# EAGLE schematic MB_2 (EAGLE 9.2.2)

## Sheet 1 of 4: Avionics
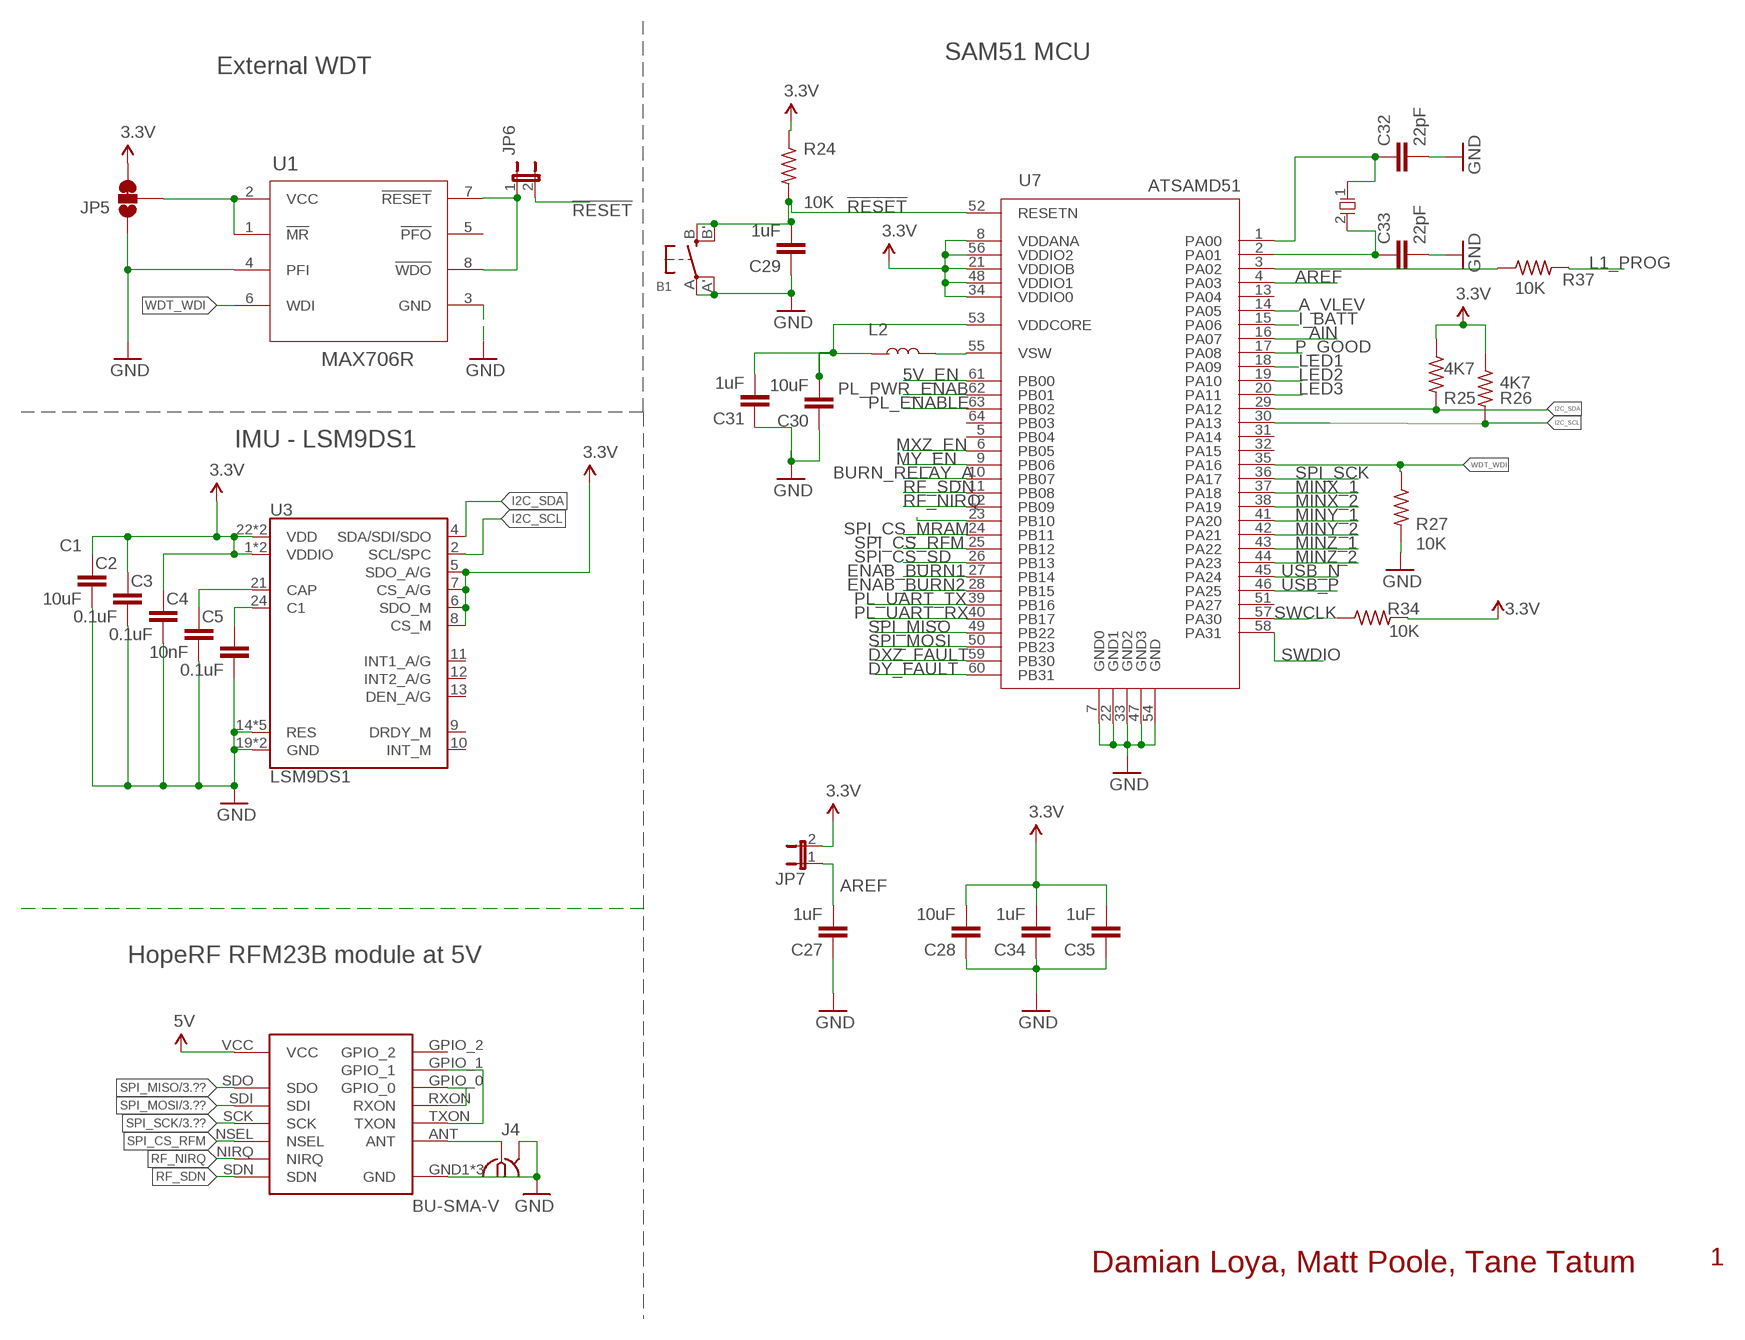
[diagram p0: schematic, sheet 1]

### Parts
B1  SWITCH_TACT_SMT4.6X2.8  [BTN_KMR2_4.6X2.8]
C1  10uF  10UF-6.3V-20%(0603)  [0603-CAP]
C2  0.1uF  0.1UF-25V(+80/-20%)(0603)  [0603-CAP]
C3  0.1uF  0.1UF-25V(+80/-20%)(0603)  [0603-CAP]
C4  10nF  10NF/10000PF-50V-10%(0603)  [0603-CAP]
C5  0.1uF  0.1UF-25V(+80/-20%)(0603)  [0603-CAP]
C27  1uF  C-EUC0603  [C0603]
C28  10uF  C-EUC0603  [C0603]
C29  1uF  C-EUC0603  [C0603]
C30  10uF  C-EUC0603  [C0603]
C31  1uF  C-EUC0603  [C0603]
C32  22pF  C-EUC0603  [C0603]
C33  22pF  C-EUC0603  [C0603]
C34  1uF  C-EUC0603  [C0603]
C35  1uF  C-EUC0603  [C0603]
J4  BU-SMA-V  [BU-SMA-V]
JP5  JUMPER-PAD-3-2OF3_NC_BY_TRACE_SMALL  [PAD-JUMPER-3-2OF3_NC_BY_TRACE_YES_SILK_FULL_BOX]
JP6  JP1E  [JP1]
JP7  JP1E  [JP1]
L2  10uH  CM322522  [1210]
R24  10K  R-US_R0603  [R0603]
R25  4K7  R-US_R0603  [R0603]
R26  4K7  R-US_R0603  [R0603]
R27  10K  R-US_R0603  [R0603]
R34  10K  R-US_R0603  [R0603]
R37  10K  R-US_R0603  [R0603]
U1  MAX706R  MAX708RESA-T  [SO8]
U3  LSM9DS1  [LGA24-8X4]
U5  RFM23BP  [RFM23BP]
U7  ATSAMD51  [TQFP-64]
X1  ECX-31B  [ECX-31B]

### Nets
3.3V: C1.1 C2.1 C3.1 C28.2 C34.2 C35.2 JP5.3 JP7.2 R24.1 R25.1 R26.1 R34.2 U3.1(VDDIO) U3.3(VDDIO) U3.5(SDO_A/G) U3.6(SDO_M) U3.7(CS_A/G) U3.8(CS_M) U3.22(VDD) U3.23(VDD) U7.8(VDDANA) U7.21(VDDIOB) U7.34(VDDIO0) U7.48(VDDIO1) U7.56(VDDIO2) ; also sheet 2,3
5V: U5.VCC ; also sheet 2
5V_EN: U7.61(PB00) ; also sheet 2
!RESET: B1.B'(S1) B1.B(S) C29.2 JP6.2 R24.2 U7.52(RESETN) ; also sheet 3
A_VLEV: U7.14(PA05) ; also sheet 2
AIN: U7.16(PA07)
AREF: C27.2 JP7.1 U7.4(PA03)
BURN_RELAY_A: U7.10(PB07) ; also sheet 4
DXZ_FAULT: U7.59(PB30) ; also sheet 4
DY_FAULT: U7.60(PB31) ; also sheet 4
ENAB_BURN1: U7.27(PB14) ; also sheet 4
ENAB_BURN2: U7.28(PB15) ; also sheet 4
GND: B1.A'(P1) B1.A(P) C1.2 C2.2 C3.2 C4.2 C5.2 C27.1 C28.1 C29.1 C30.1 C31.1 C32.2 C33.2 C34.1 C35.1 J4.2 J4.3 J4.4 J4.5 JP5.1 R27.2 U1.3(GND) U1.4(PFI) U3.14(RES) U3.15(RES) U3.16(RES) U3.17(RES) U3.18(RES) U3.19(GND) U3.20(GND) U5.GND1(GND) U5.GND2(GND) U5.GND3(GND) U7.7(GND0) U7.22(GND1) U7.33(GND2) U7.47(GND3) U7.54(GND) ; also sheet 2,3,4
I2C_SCL: R26.2 U3.2(SCL/SPC) U7.30(PA13)
I2C_SDA: R25.2 U3.4(SDA/SDI/SDO) U7.29(PA12)
I_BATT: U7.15(PA06) ; also sheet 2
L1_PROG: R37.2 ; also sheet 2
LED1: U7.18(PA09) ; also sheet 2
LED2: U7.19(PA10) ; also sheet 2
LED3: U7.20(PA11) ; also sheet 2
LED4: U7.23(PB10) ; also sheet 2
MINX_1: U7.37(PA18) ; also sheet 4
MINX_2: U7.38(PA19) ; also sheet 4
MINY_1: U7.41(PA20) ; also sheet 4
MINY_2: U7.42(PA21) ; also sheet 4
MINZ_1: U7.43(PA22) ; also sheet 4
MINZ_2: U7.44(PA23) ; also sheet 4
MXZ_EN: U7.6(PB05) ; also sheet 4
MY_EN: U7.9(PB06) ; also sheet 4
N$1: JP6.1 U1.7(!RESET) U1.8(!WDO)
N$2: C4.1 U3.21(CAP)
N$6: C5.1 U3.24(C1)
N$8: JP5.2 U1.1(!MR) U1.2(VCC)
N$15: L2.2 U7.55(VSW)
N$29: C32.1 U7.1(PA00) X1.1
N$36: J4.1 U5.ANT
N$37: U5.GPIO_0 U5.RXON
N$39: U5.GPIO_1 U5.TXON
N$43: C30.2 C31.2 L2.1 U7.53(VDDCORE)
N$44: C33.1 U7.2(PA01) X1.2
N$56: R37.1 U7.3(PA02)
P_GOOD: U7.17(PA08) ; also sheet 2
PL_ENABLE: U7.63(PB02) ; also sheet 3
PL_PWR_ENAB: U7.62(PB01) ; also sheet 2
PL_UART_RX: U7.40(PB17) ; also sheet 3
PL_UART_TX: U7.39(PB16) ; also sheet 3
RF_NIRQ: U5.NIRQ U7.12(PB09)
RF_SDN: U5.SDN U7.11(PB08)
SPI_CS_MRAM: U7.24(PB11) ; also sheet 3
SPI_CS_RFM: U5.NSEL U7.25(PB12)
SPI_CS_SD: U7.26(PB13) ; also sheet 3
SPI_MISO: U5.SDO U7.49(PB22) ; also sheet 3
SPI_MOSI: U5.SDI U7.50(PB23) ; also sheet 3
SPI_SCK: U5.SCK U7.36(PA17) ; also sheet 3
SWCLK: R34.1 U7.57(PA30) ; also sheet 3
SWDIO: U7.58(PA31) ; also sheet 3
USB_N: U7.45(PA24) ; also sheet 3
USB_P: U7.46(PA25) ; also sheet 3
WDT_WDI: R27.1 U1.6(WDI) U7.35(PA16)
Unconnected: U1.5(!PFO) U3.9(DRDY_M) U3.10(INT_M) U3.11(INT1_A/G) U3.12(INT2_A/G) U3.13(DEN_A/G) U5.GPIO_2 U7.5(PB04) U7.13(PA04) U7.31(PA14) U7.32(PA15) U7.51(PA27) U7.64(PB03)

### Notes on the sheet
- SAM51 MCU
- External WDT
- Decide on HOLD and !WP
- IMU - LSM9DS1
- HopeRF RFM23B module at 5V
- To Do:
  Characterize power consumption
  Validate SPI pinout of SAMD21
- Damian Loya, Matt Poole, Tane Tatum | 1

## Sheet 2 of 4: Power
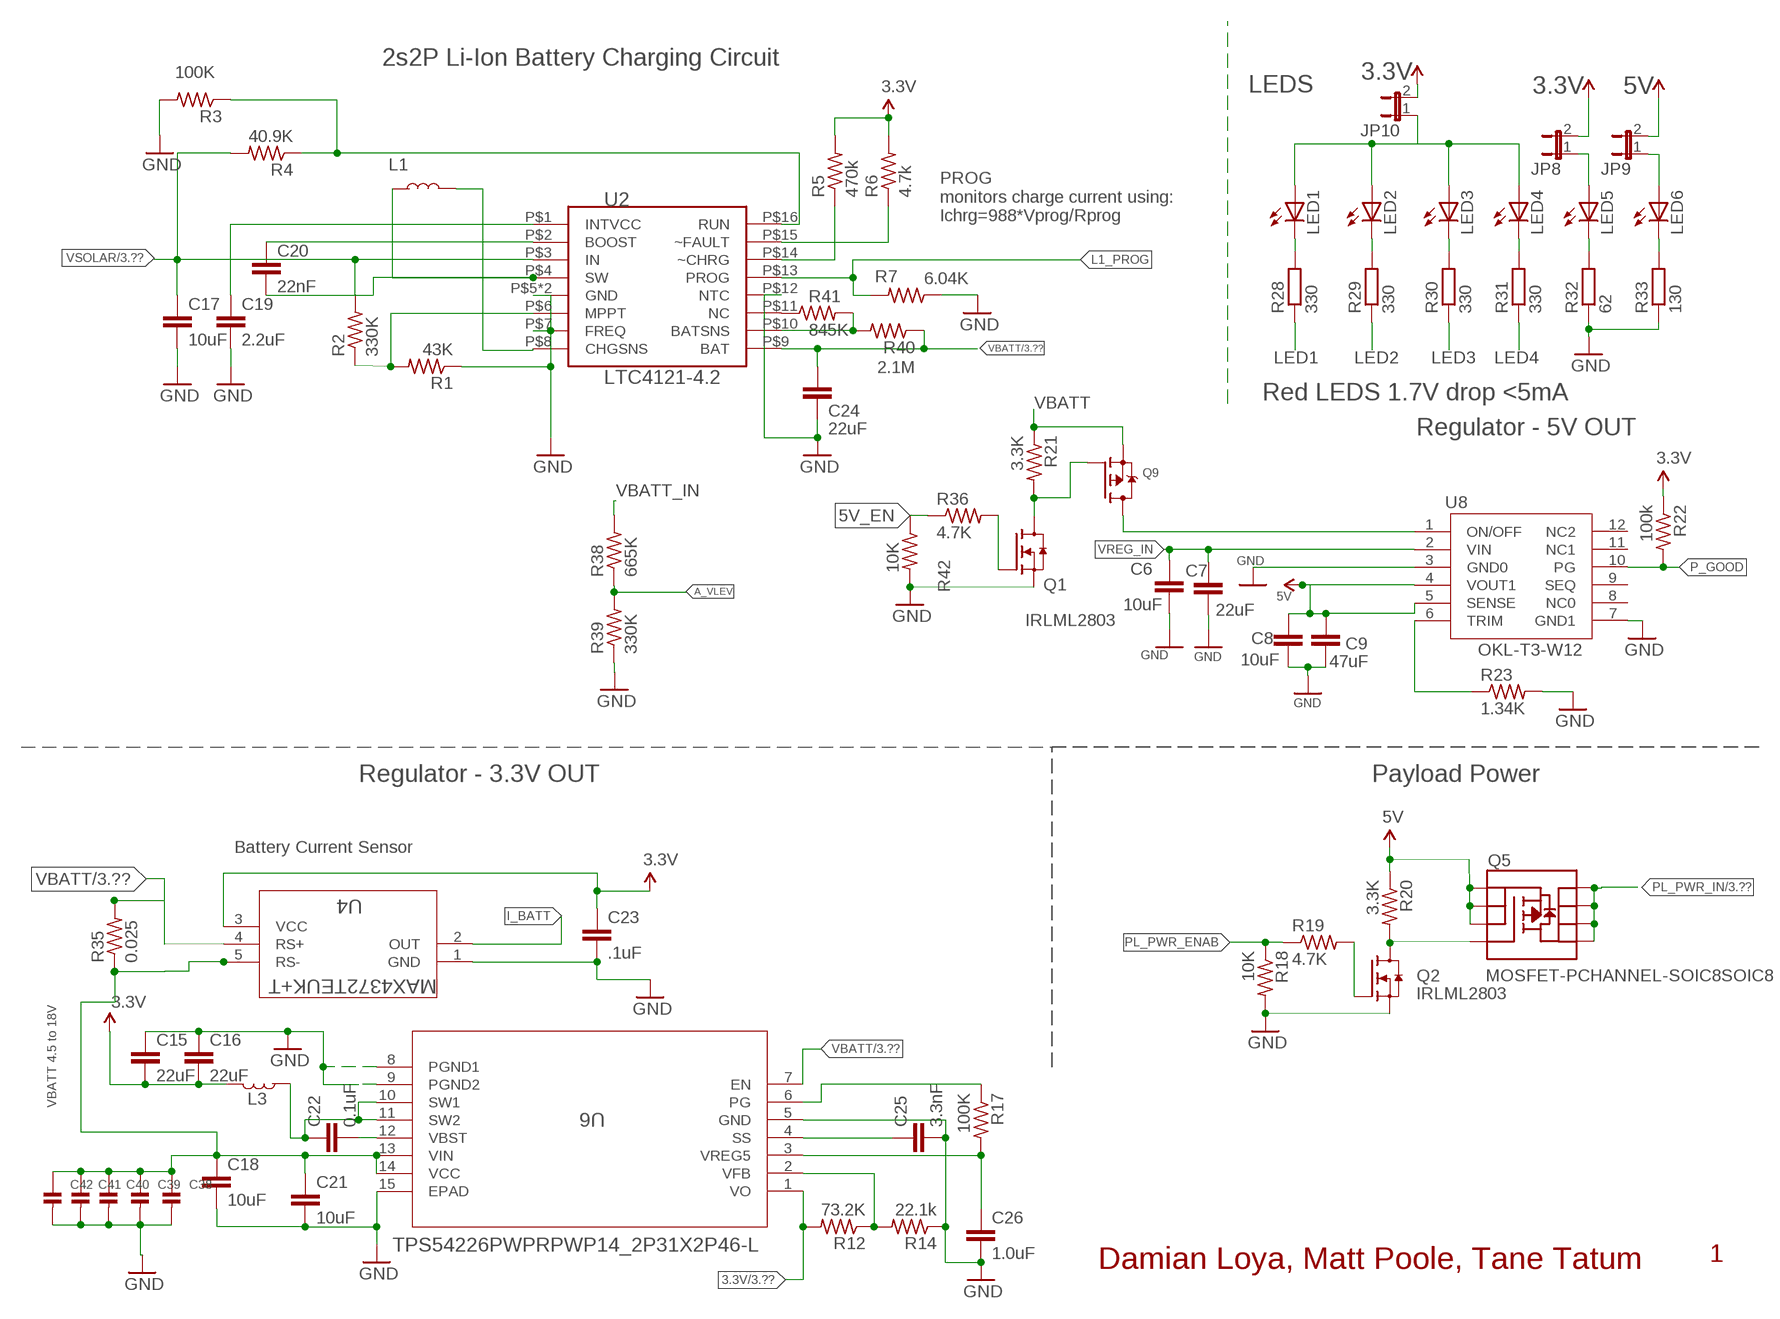
[diagram p1: schematic, sheet 2]

### Parts
C6  10uF  10UF-0603-6.3V-20%  [0603]
C7  22uF  10UF-0603-6.3V-20%  [0603]
C8  10uF  10UF-0603-6.3V-20%  [0603]
C9  47uF  10UF-0603-6.3V-20%  [0603]
C15  22uF  22UF-0805-6.3V-20%  [0805]
C16  22uF  22UF-0805-6.3V-20%  [0805]
C17  10uF  10UF-0603-6.3V-20%  [0603]
C18  10uF  10UF-0603-6.3V-20%  [0603]
C19  2.2uF  2.2UF-0603-10V-20%  [0603]
C20  22nF  2.2NF/2200PF-0603-50V-10%  [0603]
C21  10uF  10UF-0603-6.3V-20%  [0603]
C22  0.1uF  1.0UF-0603-16V-10%  [0603]
C23  .1uF  CAP0603-CAP  [0603-CAP]
C24  22uF  0.1UF-0603-25V-5%  [0603]
C25  3.3nF  3.3NF-0603-100V-10%  [0603]
C26  1.0uF  1.0UF-0603-16V-10%  [0603]
C38  CAP_CERAMIC1206  [1206]
C39  CAP_CERAMIC1206  [1206]
C40  CAP_CERAMIC1206  [1206]
C41  CAP_CERAMIC1206  [1206]
C42  CAP_CERAMIC1206  [1206]
JP8  JP1E  [JP1]
JP9  JP1E  [JP1]
JP10  JP1E  [JP1]
L1  56uH  CM322522  [1210]
L3  3.3uH  CM322522  [1210]
LED1  LEDCHIP-LED0603  [CHIP-LED0603]
LED2  LEDCHIP-LED0603  [CHIP-LED0603]
LED3  LEDCHIP-LED0603  [CHIP-LED0603]
LED4  LEDCHIP-LED0603  [CHIP-LED0603]
LED5  LEDCHIP-LED0603  [CHIP-LED0603]
LED6  LEDCHIP-LED0603  [CHIP-LED0603]
Q1  IRLML2803  IRLML2803TRPBF  [SOT-23]
Q2  IRLML2803  IRLML2803TRPBF  [SOT-23]
Q5  MOSFET-PCHANNEL-SOIC8SOIC8  [SO08]
Q9  MOSFET-PWIDE  [SOT23-WIDE]
R1  43K  R-US_R0603  [R0603]
R2  330K  R-US_R0603  [R0603]
R3  100K  R-US_R0603  [R0603]
R4  40.9K  R-US_R0603  [R0603]
R5  470k  R-US_R0603  [R0603]
R6  4.7k  R-US_R0603  [R0603]
R7  6.04K  R-US_R0603  [R0603]
R12  73.2K  R-US_R0603  [R0603]
R14  22.1k  R-US_R0603  [R0603]
R17  100K  R-US_R0603  [R0603]
R18  10K  R-US_R0603  [R0603]
R19  4.7K  R-US_R0603  [R0603]
R20  3.3K  R-US_R0603  [R0603]
R21  3.3K  R-US_R0603  [R0603]
R22  100k  R-US_R0603  [R0603]
R23  1.34K  R-US_R0603  [R0603]
R28  330  R-EU_R0603  [R0603]
R29  330  R-EU_R0603  [R0603]
R30  330  R-EU_R0603  [R0603]
R31  330  R-EU_R0603  [R0603]
R32  62  R-EU_R0603  [R0603]
R33  130  R-EU_R0603  [R0603]
R35  0.025  R-US_R1210  [R1210]
R36  4.7K  R-US_R0603  [R0603]
R38  665K  R-US_R0603  [R0603]
R39  330K  R-US_R0603  [R0603]
R40  2.1M  R-US_R0603  [R0603]
R41  845K  R-US_R0603  [R0603]
R42  10K  R-US_R0603  [R0603]
U2  LTC4121-4.2  [QFN-16-PAD]
U4  MAX4372TEUK+T  [21-0057F]
U6  TPS54226PWPRPWP14_2P31X2P46-L  [PWP14_2P31X2P46-L]
U8  OKL-T3-W12  [OKL-T3-W12]

### Nets
3.3V: C15.2 C16.2 C23.1 JP8.2 JP10.2 L3.2 R5.2 R6.2 R12.2 R22.1 U4.3(VCC) U6.1(VO) ; also sheet 1,3
5V: C8.1 C9.1 JP9.2 Q5.1(S) Q5.2(S) Q5.3(S) R20.1 U8.4(VOUT1) U8.5(SENSE) ; also sheet 1
5V_EN: R36.1 R42.1 ; also sheet 1
A_VLEV: R38.1 R39.2 ; also sheet 1
GND: C6.2 C7.2 C8.2 C9.2 C15.1 C16.1 C17.2 C18.2 C19.2 C21.2 C23.2 C24.2 C25.2 C26.2 C38.2 C39.2 C40.2 C41.2 C42.2 Q1.2(S) Q2.2(S) R1.1 R3.2 R7.1 R14.1 R18.2 R23.2 R32.1 R33.1 R39.1 R42.2 U2.P$5(GND) U2.P$7(FREQ) U2.P$12(NTC) U2.P$17(GND) U4.1(GND) U6.5(GND) U6.8(PGND1) U6.9(PGND2) U6.15(EPAD) U8.3(GND0) U8.7(GND1) ; also sheet 1,3,4
I_BATT: U4.2(OUT) ; also sheet 1
L1_CHG: R3.1 R4.1 U2.P$16(RUN)
L1_FAULTN: R6.1 U2.P$15(~FAULT)
L1_PROG: R7.2 U2.P$13(PROG) ; also sheet 1
LED1: R28.1 ; also sheet 1
LED2: R29.1 ; also sheet 1
LED3: R30.1 ; also sheet 1
LED4: R31.1 ; also sheet 1
N$3: C22.1 L3.1 U6.10(SW1) U6.11(SW2)
N$5: L1.2 U2.P$8(CHGSNS)
N$7: C20.2 L1.1 U2.P$4(SW)
N$9: C20.1 U2.P$2(BOOST)
N$10: Q2.1(G) R19.2
N$11: C19.1 U2.P$1(INTVCC)
N$12: Q2.3(D) Q5.4(G) R20.2
N$13: R1.2 R2.1 U2.P$6(MPPT)
N$14: C22.2 U6.12(VBST)
N$16: R5.1 U2.P$14(~CHRG)
N$17: R40.2 R41.2 U2.P$10(BATSNS)
N$18: Q1.3(D) Q9.1(G) R21.2
N$19: R23.1 U8.6(TRIM)
N$23: Q1.1(G) R36.2
N$27: LED1.C R28.2
N$32: Q9.3(D) U8.1(ON/OFF)
N$45: LED2.C R29.2
N$46: C26.1 R17.2 U6.3(VREG5)
N$47: LED3.C R30.2
N$48: LED4.C R31.2
N$49: LED5.C R32.2
N$50: LED6.C R33.2
N$51: C25.1 U6.4(SS)
N$52: R12.1 R14.2 U6.2(VFB)
N$53: JP8.1 LED5.A
N$54: R41.1 U2.P$11(NC)
N$55: JP9.1 LED6.A
N$60: JP10.1 LED1.A LED2.A LED3.A LED4.A
P_GOOD: R22.2 U8.10(PG) ; also sheet 1
PGOOD: R17.1 U6.6(PG)
PL_PWR_ENAB: R18.1 R19.1 ; also sheet 1
PL_PWR_IN: Q5.5(D) Q5.6(D) Q5.7(D) Q5.8(D) ; also sheet 3
VBATT: C24.1 Q9.2(S) R21.1 R35.2 R40.1 U2.P$9(BAT) U4.4(RS+) U6.7(EN) ; also sheet 3,4
VBATT_IN: R38.2 ; also sheet 3
VREG_IN: C6.1 C7.1 C18.1 C21.1 C38.1 C39.1 C40.1 C41.1 C42.1 R35.1 U4.5(RS-) U6.13(VIN) U6.14(VCC) U8.2(VIN)
VSOLAR: C17.1 R2.2 R4.2 U2.P$3(IN) ; also sheet 3
Unconnected: U8.8(NC0) U8.9(SEQ) U8.11(NC1) U8.12(NC2)

### Notes on the sheet
- 2s2P Li-Ion Battery Charging Circuit
- LEDS
- PROG
  monitors charge current using:
  Ichrg=988*Vprog/Rprog
- Red LEDS 1.7V drop <5mA
- Regulator - 5V OUT
- Regulator - 3.3V OUT | Payload Power
- Battery Current Sensor
- VBATT 4.5 to 18V
- Damian Loya, Matt Poole, Tane Tatum | 1

## Sheet 3 of 4: Connectors
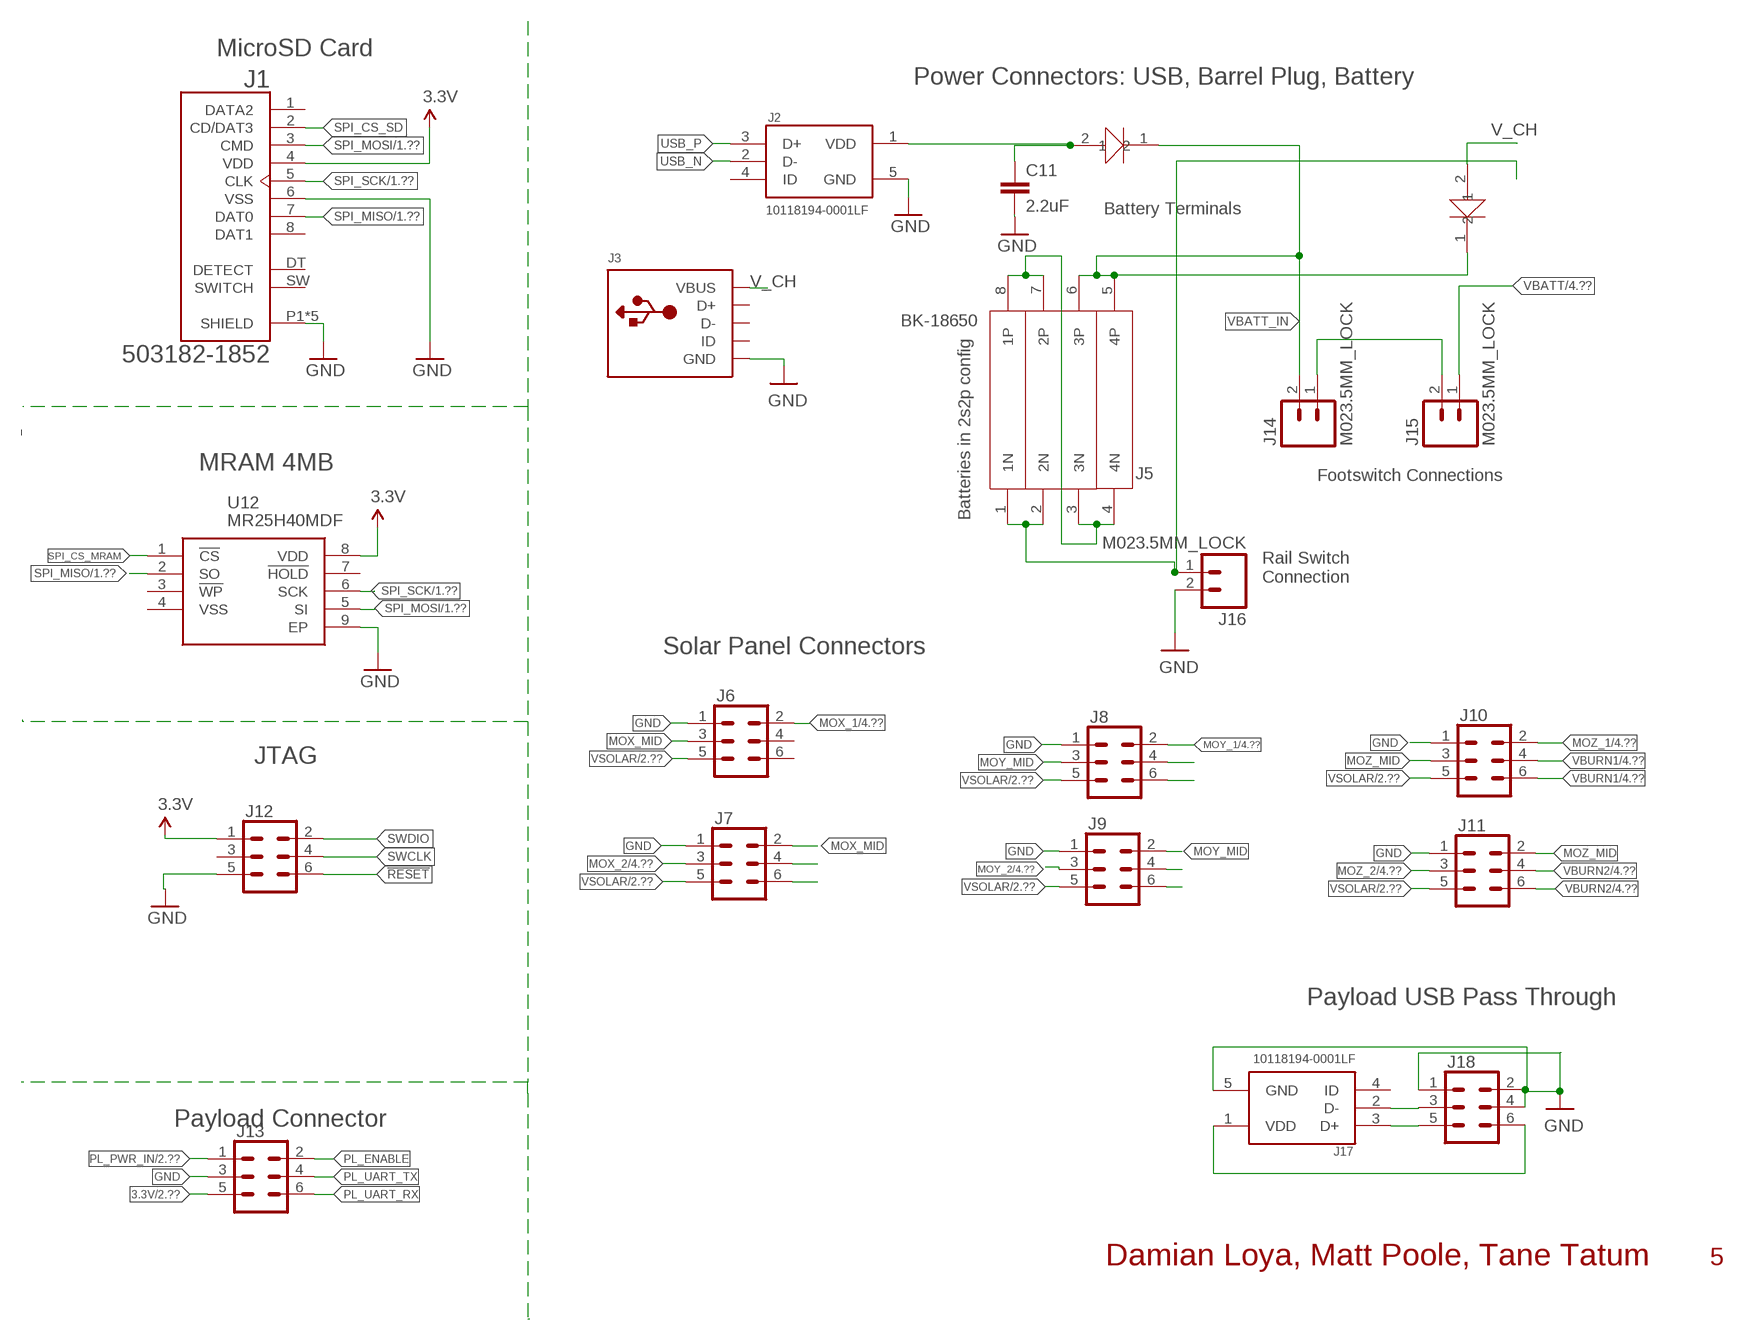
[diagram p2: schematic, sheet 3]

### Parts
C11  2.2uF  2.2UF-0603-10V-20%  [0603]
D1  RBR5LAM60ATF  [SOD-128]
D2  RBR5LAM60ATF  [SOD-128]
J1  503182-1852  [MOLEX_503182-1852]
J2  10118194-0001LF  [FRAMATOME_10118194-0001LF]
J3  USBMOLEX  [USB-MINIB-THM-MOLEX]
J5  BK-18650  [BK-18650]
J6  CONN_03X22X3_SILK_MALE_PTH  [2X3]
J7  CONN_03X22X3_SILK_MALE_PTH  [2X3]
J8  CONN_03X22X3_SILK_MALE_PTH  [2X3]
J9  CONN_03X22X3_SILK_MALE_PTH  [2X3]
J10  CONN_03X22X3_SILK_MALE_PTH  [2X3]
J11  CONN_03X22X3_SILK_MALE_PTH  [2X3]
J12  CONN_03X22X3_SILK_MALE_PTH  [2X3]
J13  CONN_03X22X3_SILK_MALE_PTH  [2X3]
J14  M023.5MM_LOCK  [SCREWTERMINAL-3.5MM-2_LOCK]
J15  M023.5MM_LOCK  [SCREWTERMINAL-3.5MM-2_LOCK]
J16  M023.5MM_LOCK  [SCREWTERMINAL-3.5MM-2_LOCK]
J17  10118194-0001LF  [FRAMATOME_10118194-0001LF]
J18  CONN_03X22X3_SILK_MALE_PTH  [2X3]
U12  MR25H40MDF  [SON127P600X500X90-9N]

### Nets
3.3V: J1.4(VDD) J12.1 J13.5 U12.8(VDD) ; also sheet 1,2
!RESET: J12.6 ; also sheet 1
GND: C11.2 J1.6(VSS) J1.P1(SHIELD) J1.P2(SHIELD) J1.P3(SHIELD) J1.P4(SHIELD) J1.P5(SHIELD) J2.5(GND) J3.GND J6.1 J7.1 J8.1 J9.1 J10.1 J11.1 J12.5 J13.3 J16.2 J17.5(GND) J18.1 J18.2 J18.4 U12.9(EP) ; also sheet 1,2,4
MOX_1: J6.2 ; also sheet 4
MOX_2: J7.3 ; also sheet 4
MOX_MID: J6.3 J7.2
MOY_1: J8.2 ; also sheet 4
MOY_2: J9.3 ; also sheet 4
MOY_MID: J8.3 J9.2
MOZ_1: J10.2 ; also sheet 4
MOZ_2: J11.3 ; also sheet 4
MOZ_MID: J10.3 J11.2
N$4: J14.1 J15.2
N$20: C11.1 D2.2 J2.1(VDD)
N$21: J17.2(D-) J18.3
N$22: J17.3(D+) J18.5
N$40: J17.1(VDD) J18.6
N$41: J5.3(3N) J5.4(4N) J5.7(2P) J5.8(1P)
N$59: J5.1(1N) J5.2(2N) J16.1
N$63: J7.6
N$64: J7.4
N$65: J8.6
N$66: J8.4
N$67: J9.6
N$68: J9.4
PL_ENABLE: J13.2 ; also sheet 1
PL_PWR_IN: J13.1 ; also sheet 2
PL_UART_RX: J13.6 ; also sheet 1
PL_UART_TX: J13.4 ; also sheet 1
SPI_CS_MRAM: U12.1(!CS) ; also sheet 1
SPI_CS_SD: J1.2(CD/DAT3) ; also sheet 1
SPI_MISO: J1.7(DAT0) U12.2(SO) ; also sheet 1
SPI_MOSI: J1.3(CMD) U12.5(SI) ; also sheet 1
SPI_SCK: J1.5(CLK) U12.6(SCK) ; also sheet 1
SWCLK: J12.4 ; also sheet 1
SWDIO: J12.2 ; also sheet 1
USB_N: J2.2(D-) ; also sheet 1
USB_P: J2.3(D+) ; also sheet 1
V_CH: D1.2 J3.VBUS
VBATT: J15.1 ; also sheet 2,4
VBATT_IN: D1.1 D2.1 J5.5(4P) J5.6(3P) J14.2 ; also sheet 2
VBURN1: J10.4 J10.6 ; also sheet 4
VBURN2: J11.4 J11.6 ; also sheet 4
VSOLAR: J6.5 J7.5 J8.5 J9.5 J10.5 J11.5 ; also sheet 2
Unconnected: J1.1(DATA2) J1.8(DAT1) J1.DT(DETECT) J1.SW(SWITCH) J2.4(ID) J3.D+ J3.D- J3.ID J6.4 J6.6 J12.3 J17.4(ID) U12.3(!WP) U12.4(VSS) U12.7(!HOLD)

### Notes on the sheet
- MicroSD Card
- Power Connectors: USB, Barrel Plug, Battery
- Battery Terminals
- MRAM 4MB
- Footswitch Connections
- Batteries in 2s2p config
- Rail Switch
  Connection
- Solar Panel Connectors
- JTAG
- Payload USB Pass Through
- Payload Connector
- Damian Loya, Matt Poole, Tane Tatum | 5

## Sheet 4 of 4: Burn Wires and H-Bridges
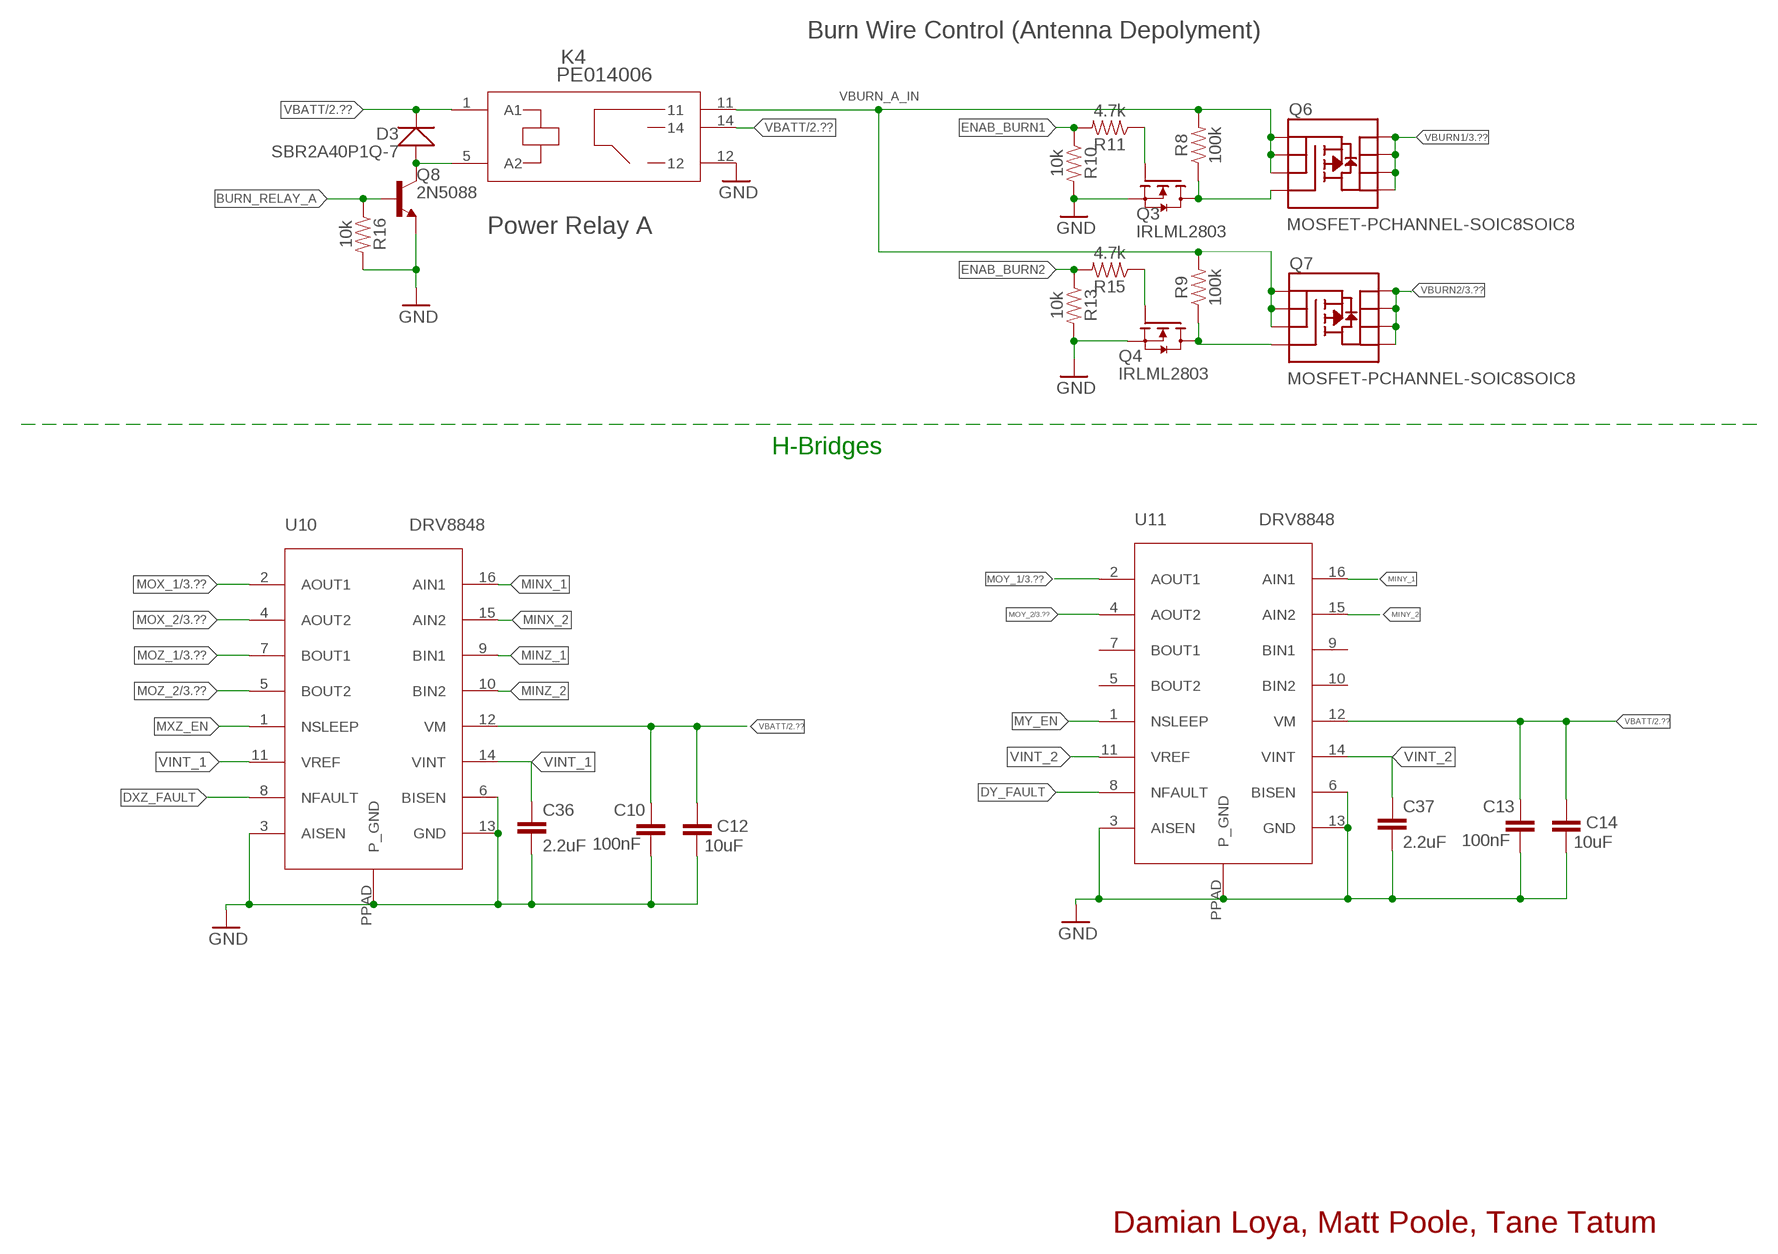
[diagram p3: schematic, sheet 4]

### Parts
C10  100nF  10UF-0603-6.3V-20%  [0603]
C12  10uF  10UF-0603-6.3V-20%  [0603]
C13  100nF  10UF-0603-6.3V-20%  [0603]
C14  10uF  10UF-0603-6.3V-20%  [0603]
C36  2.2uF  CAP0603-CAP  [0603-CAP]
C37  2.2uF  CAP0603-CAP  [0603-CAP]
D3  SBR2A40P1Q-7  DFLS130L  [PWRDI-123]
K4  PE014006  PE014005  [RELAY5-PE_CO]
Q3  IRLML2803  IRLML2803TRPBF  [SOT-23]
Q4  IRLML2803  IRLML2803TRPBF  [SOT-23]
Q6  MOSFET-PCHANNEL-SOIC8SOIC8  [SO08]
Q7  MOSFET-PCHANNEL-SOIC8SOIC8  [SO08]
Q8  2N5088  BC846  [SOT23]
R8  100k  RESISTOR0603  [0603]
R9  100k  RESISTOR0603  [0603]
R10  10k  RESISTOR0603  [0603]
R11  4.7k  RESISTOR0603  [0603]
R13  10k  RESISTOR0603  [0603]
R15  4.7k  RESISTOR0603  [0603]
R16  10k  RESISTOR0603  [0603]
U10  DRV8848  [HTSSOP]
U11  DRV8848  [HTSSOP]

### Nets
BURN_RELAY_A: Q8.1(B) R16.1 ; also sheet 1
DXZ_FAULT: U10.8(NFAULT) ; also sheet 1
DY_FAULT: U11.8(NFAULT) ; also sheet 1
ENAB_BURN1: R10.1 R11.2 ; also sheet 1
ENAB_BURN2: R13.1 R15.2 ; also sheet 1
GND: C10.2 C12.2 C13.2 C14.2 C36.2 C37.2 K4.12 Q3.2(S) Q4.2(S) Q8.2(E) R10.2 R13.2 R16.2 U10.3(AISEN) U10.6(BISEN) U10.13(GND) U10.PPAD(P_GND) U11.3(AISEN) U11.6(BISEN) U11.13(GND) U11.PPAD(P_GND) ; also sheet 1,2,3
MINX_1: U10.16(AIN1) ; also sheet 1
MINX_2: U10.15(AIN2) ; also sheet 1
MINY_1: U11.16(AIN1) ; also sheet 1
MINY_2: U11.15(AIN2) ; also sheet 1
MINZ_1: U10.9(BIN1) ; also sheet 1
MINZ_2: U10.10(BIN2) ; also sheet 1
MOX_1: U10.2(AOUT1) ; also sheet 3
MOX_2: U10.4(AOUT2) ; also sheet 3
MOY_1: U11.2(AOUT1) ; also sheet 3
MOY_2: U11.4(AOUT2) ; also sheet 3
MOZ_1: U10.7(BOUT1) ; also sheet 3
MOZ_2: U10.5(BOUT2) ; also sheet 3
MXZ_EN: U10.1(NSLEEP) ; also sheet 1
MY_EN: U11.1(NSLEEP) ; also sheet 1
N$31: Q3.3(D) Q6.4(G) R8.1
N$33: Q3.1(G) R11.1
N$34: Q4.1(G) R15.1
N$35: D3.A K4.5(A2) Q8.3(C)
N$58: Q4.3(D) Q7.4(G) R9.1
VBATT: C10.1 C12.1 C13.1 C14.1 D3.C K4.1(A1) K4.14 U10.12(VM) U11.12(VM) ; also sheet 2,3
VBURN1: Q6.5(D) Q6.6(D) Q6.7(D) Q6.8(D) ; also sheet 3
VBURN2: Q7.5(D) Q7.6(D) Q7.7(D) Q7.8(D) ; also sheet 3
VBURN_A_IN: K4.11 Q6.1(S) Q6.2(S) Q6.3(S) Q7.1(S) Q7.2(S) Q7.3(S) R8.2 R9.2
VINT_1: C36.1 U10.11(VREF) U10.14(VINT)
VINT_2: C37.1 U11.11(VREF) U11.14(VINT)
Unconnected: U11.5(BOUT2) U11.7(BOUT1) U11.9(BIN1) U11.10(BIN2)

### Notes on the sheet
- Burn Wire Control (Antenna Depolyment)
- Power Relay A
- H-Bridges
- Damian Loya, Matt Poole, Tane Tatum

## Library data of the parts
B1 = microbuilder:SWITCH_TACT_SMT: SMT Tact Switches 6x6mm - Digikey: P12940SCT-ND KMR2 (4.6x2.8mm) - Digikey: 401-1426-1-ND EVQ-PQHB55 - Light Touch, 160GF (4.5x4.5mm) - Digikey: P8090SCT-ND
C1 = SparkFun-Capacitors:10UF-6.3V-20%(0603): CAP-11015; PROD_ID: CAP-11015
C2 C3 C5 = SparkFun-Capacitors:0.1UF-25V(+80/-20%)(0603): CAP-00810 Ceramic Standard decoupling cap; PROD_ID: CAP-00810
C4 = SparkFun-Capacitors:10NF/10000PF-50V-10%(0603): CAP-00867; PROD_ID: CAP-00867
C6 C8 C12 C14 C17 C18 C21 = SparkFun-Capacitors:10UF: 10.0µF ceramic capacitors A capacitor is a passive two-terminal electrical component used to store electrical energy temporarily in an electric field.; PROD_ID: CAP-11015
C7 C9 C10 C13 = SparkFun-Capacitors:10UF: 10.0µF ceramic capacitors A capacitor is a passive two-terminal electrical component used to store electrical energy temporarily in an electric field.; PROD_ID: CAP-11015; VALUE: 10uF
C11 C19 = SparkFun-Capacitors:2.2UF: 2.2µF ceramic capacitors A capacitor is a passive two-terminal electrical component used to store electrical energy temporarily in an electric field.; PROD_ID: CAP-07888
C15 C16 = SparkFun-Capacitors:22UF: 22µF ceramic capacitors A capacitor is a passive two-terminal electrical component used to store electrical energy temporarily in an electric field.; PROD_ID: CAP-08402
C20 = SparkFun-Capacitors:2.2NF/2200PF: 2.2nF/2,200pF ceramic capacitors A capacitor is a passive two-terminal electrical component used to store electrical energy temporarily in an electric field.; PROD_ID: CAP-07877; VALUE: 2.2nF
C22 = SparkFun-Capacitors:1.0UF: 1µF ceramic capacitors A capacitor is a passive two-terminal electrical component used to store electrical energy temporarily in an electric field.; PROD_ID: CAP-00868; VALUE: 1.0uF
C23 = SparkFun-Capacitors:CAP: Capacitor Standard 0603 ceramic capacitor, and 0.1" leaded capacitor.
C24 = SparkFun-Capacitors:0.1UF: 0.1µF ceramic capacitors A capacitor is a passive two-terminal electrical component used to store electrical energy temporarily in an electric field.; PROD_ID: CAP-08604; VALUE: 0.1uF
C25 = SparkFun-Capacitors:3.3NF: 3.3nF ceramic capacitors A capacitor is a passive two-terminal electrical component used to store electrical energy temporarily in an electric field.; PROD_ID: CAP-09633
C26 = SparkFun-Capacitors:1.0UF: 1µF ceramic capacitors A capacitor is a passive two-terminal electrical component used to store electrical energy temporarily in an electric field.; PROD_ID: CAP-00868
C27-C35 = resistor:C-EU: CAPACITOR, European symbol
C36 C37 = SparkFun-Capacitors:CAP: Capacitor Standard 0603 ceramic capacitor, and 0.1" leaded capacitor.; VOLTAGE: 6.3V
C38-C42 = microbuilder:CAP_CERAMIC: Ceramic Capacitors 0402 - 0402 Surface Mount Capacitors 16pF 50V 5% [Digikey: 445-4899-2-ND] 18pF 50V 5% [Digikey: 490-1281-2-ND] 22pF 50V 5% [Digikey: 490-1283-2-ND] 68pF 50V 5% [Digikey: 490-1289-2-ND] 0.1uF 10V 10% [Digikey: 490-1318-2-ND] 1.0uF 6.3V 10% [Digikey: 490-1320-2-ND] 0603 - 0603 Surface Mount Capacitors 16 pF 50V 5% [Digikey: 445-5051-2-ND] 22 pF 50V [Digikey: PCC220ACVTR-ND] 33 pF 50V 5% [Digikey: 490-1415-1-ND] 56pF 50V 5% [Digikey: 490-1421-1-ND] 220pF 50V 5% [Digikey: 445-1285-1-ND] 680 pF 50V 2200 pF 50V 5% C0G [Digikey: 445-1297-1-ND] 5600 pF 100V 5% X7R [Digikey: 478-3711-1-ND] 0.1 µF 25V 10% [Digikey: PCC2277TR-ND] 0.22 µF 16V 10% X7R [Digikey: 445-1318-1-ND] 1.0 µF 25V 10% [Digikey: 445-5146-2-ND] 0603 - RF Specific 3pF 250V +/-0.1pF RF [Digikey: 712-1347-1-ND] 18 pF 250V 5% [Digikey: 478-3505-1-ND or 712-1322-1-ND] 56 pF 250V 5% C0G RF [Digikey: 490-4867-1-ND] 68 pF 250V RF [Digikey: 490-4868-1-ND] 0805 - 0805 Surface Mount Capacitors 220 pF 250V 2% RF Ceramic Capacitor [Digikey: 712-1398-1-ND] 1000 pF 50V 2% NP0 Ceramic Capacitor [Digikey: 478-3760-1-ND] 0.1 µF 25V 10% Ceramic Capacitor [Digikey: PCC1828TR-ND] 1.0 µF 16V 10% Ceramic Capacitor[Digikey: 490-1691-2-ND] 10.0 µF 10V 10% Ceramic Capacitor[Digikey: 709-1228-1-ND] 10.0 uF 16V 10% Ceramic Capacitor [Digikey: 478-5165-2-ND] 47 uF 6.3V 20% Ceramic Capacitor [Digikey: 587-1779-1-ND or 399-5506-1-ND] 1206 - 1206 Surface Mount Capacitors 47uF 10V 20% Ceramic Capacitor [Digikey: 490-5528-1-ND or 399-5508-1-ND or 445-6010-1-ND] 100uF 6.3V -20%, +80% Y5V Ceramic Capacitor (Digikey: 490-4512-1-ND, Mouser: 81-GRM31CF50J107ZE1L)
D1 D2 = pandasat:RBR5LAM60ATF
D3 = BrownSpaceEngineering:DFLS130L
J1 = maholli:503182-1852: Conn Micro SD Card M 8 POS 1.09mm Solder RA SMD Embossed T/R 0.5A/Contact; DESCRIPTION: 1.10mm Pitch microSD Memory Card Connector, Normal Mount Surface Mount, Push-Push Type, 1.45mm Height, Anti-card fly-out; DIGI-KEY_PART_NUMBER: WM12834CT-ND; DIGI-KEY_PURCHASE_URL: https://www.digikey.com/product-detail/en/molex-llc/5031821852/WM12834CT-ND/5823232?WT.z_cid=ref_snapeda&utm_source=snapeda&utm_medium=aggregator&utm_campaign=buynow; MF: Molex; MP: 5031821852; PACKAGE: None
J2 J17 = 10118194-0001LF:10118194-0001LF: Conn Micro USB Type B RCP 5 POS 0.65mm Solder RA SMD 5 Terminal 1 Port T/R; AVAILABILITY: Warning; DESCRIPTION: Micro Usb, 2.0 Type b, Rcpt, Smt; MF: Amphenol; MP: 10118194-0001LF; PACKAGE: None; PRICE: 0.26 USD
J3 = adafruit:USB: USB Connectors USBMINIB - Surface Mount Female Mini-B USB Connector 4UConnector: 06564 By microbuilder.eu Thru-hole RA Female Mini-B USB Connector 4UConnector: 18732 By ladyada.net
J4 = con-coax:BU-SMA-V: FEMALE SMA CONNECTOR Radiall distributor RS 112-3794; OC_FARNELL: unknown; OC_NEWARK: unknown
J5 = pandasat:BK-18650
J6-J13 J18 = pandasat:CONN_03X2: Multi connection point. Often used as Generic Header-pin footprint for 0.1 inch spaced/style header connections You can populate with any combo of single row headers, but if you'd like an exact match, check these: Header - 2x3 (Male, 0.1") <https://www.sparkfun.com/products/12807> (PRT-12807) Header - 2x3 (Female, 0.1") <https://www.sparkfun.com/products/13010> (PRT-13010) 2x3 Pin Shrouded Header <https://www.sparkfun.com/products/10877> (PRT-10877) On any of the 0.1 inch spaced packages, you can populate with these: Break Away Headers - Straight <https://www.sparkfun.com/products/116> (PRT-00116) Break Away Male Headers - Right Angle <https://www.sparkfun.com/products/553> (PRT-00553) Female Headers <https://www.sparkfun.com/products/115> (PRT-00115) Break Away Headers - Machine Pin <https://www.sparkfun.com/products/117> (PRT-00117) Break Away Female Headers - Swiss Machine Pin <https://www.sparkfun.com/products/743> (PRT-00743) Special note: the shrouded connector mates well with our 3x2 ribbon cables: Ribbon Crimp Connector - 6-pin (2x3, Female) <https://www.sparkfun.com/products/10651> (PRT-10651) Ribbon Cable - 6 wire (15ft) <https://www.sparkfun.com/products/10646> (PRT-10646); PROD_ID: CONN-09701
J14-J16 = SparkFun-Connectors:M02: Standard 2-pin 0.1" header. Use with - straight break away headers ( PRT-00116) - right angle break away headers (PRT-00553) - swiss pins (PRT-00743) - machine pins (PRT-00117) - female headers (PRT-00115) Molex polarized connector foot print use with: PRT-08233 with associated crimp pins and housings. 2.54_SCREWTERM for use with PRT-10571. 3.5mm Screw Terminal footprints for PRT-08084 5mm Screw Terminal footprints for use with PRT-08432; PROD_ID: CONN-08399
JP5 = SparkFun-Passives:JUMPER-PAD-3-2OF3_NC_BY_TRACE
JP6-JP10 = jumper:JP1E: JUMPER
K4 = maholli:PE014005; MANUFACTURER_PART_NUMBER: PE014005; VENDOR: TE Connectivity
L1-L3 = pandasat:CM322522
LED1-LED6 = adafruit:LED: LED OSRAM: - CHIPLED LG R971, LG N971, LY N971, LG Q971, LY Q971, LO R971, LY R971 LH N974, LH R974 LS Q976, LO Q976, LY Q976 LO Q996 - Hyper CHIPLED LW Q18S LB Q993, LB Q99A, LB R99A - SideLED LS A670, LO A670, LY A670, LG A670, LP A670 LB A673, LV A673, LT A673, LW A673 LH A674 LY A675 LS A676, LA A676, LO A676, LY A676, LW A676 LS A679, LY A679, LG A679 - Hyper Micro SIDELED® LS Y876, LA Y876, LO Y876, LY Y876 LT Y87S - SmartLED LW L88C, LW L88S LB L89C, LB L89S, LG L890 LS L89K, LO L89K, LY L89K LS L896, LA L896, LO L896, LY L896 - TOPLED LS T670, LO T670, LY T670, LG T670, LP T670 LSG T670, LSP T670, LSY T670, LOP T670, LYG T670 LG T671, LOG T671, LSG T671 LB T673, LV T673, LT T673, LW T673 LH T674 LS T676, LA T676, LO T676, LY T676, LB T676, LH T676, LSB T676, LW T676 LB T67C, LV T67C, LT T67C, LS T67K, LO T67K, LY T67K, LW E67C LS E67B, LA E67B, LO E67B, LY E67B, LB E67C, LV E67C, LT E67C LW T67C LS T679, LY T679, LG T679 LS T770, LO T770, LY T770, LG T770, LP T770 LB T773, LV T773, LT T773, LW T773 LH T774 LS E675, LA E675, LY E675, LS T675 LS T776, LA T776, LO T776, LY T776, LB T776 LHGB T686 LT T68C, LB T68C - Hyper Mini TOPLED® LB M676 - Mini TOPLED Santana® LG M470 LS M47K, LO M47K, LY M47K Source: http://www.osram.convergy.de/
Q1-Q4 = maholli:IRLML2803TRPBF; MANUFACTURER_PART_NUMBER: IRLML2803TRPBF; VENDOR: LITEON
Q5-Q7 = SparkFun-DiscreteSemi:MOSFET-PCHANNEL-SOIC8: Generic 8-pin PMOSFET
Q8 = transistor:BC846: NPN TRANSISTOR
Q9 = microbuilder:MOSFET-P: P-Channel Mosfet LEGEND VDS: Voltage Drain-Source ID: Drain Current RDS(ON): Drain-Source On-State Resistance VGS(TH): Gate-Source Threshold Voltage CISS: Drain-Source Input Capacitance SOT-23 Name VDS ID RDS(ON) VGS(TH) CISS Order Number IRLML5103 30V 760mA 600 mOhm -- 75pF @ 25V Digikey: IRLML5103PBFCT-ND IRLML6401 12V 4.3A 50 mOhm 950mV @ 250µA 830pF @ 10V Digikey: IRLML6401PBFTR-ND NTR0202PL 20V 400mA 800 mOhm 2.3V @ 250uA 70pF @ 5V Digikey: NTR0202PLT1GOSTR-ND NTR4101PT1G 20V 1.8A 85 mOhm 1.2V @ 250uA 675pF @ 10V Digikey: NTR4101PT1GOSCT-ND DMP2004K 20V 600mA 900 mOhm 1V @ 250uA 175pF @ 16V Digikey: DMP2004KDICT-ND PMV65XP 20V 3.9A 76 mOhm 950mV @ 1mA 725pF @ 20V Digikey: 568-2358-2-ND TO-252 Name VDS ID RDS(ON) VGS(TH) CISS Order Number AOD417 30V 25A 34 mOhm 3V @ 250µA 920pF @ 15V Digikey: 785-1106-2-ND
R1-R7 R12 R14 R17-R27 R34-R42 = resistor:R-US_: RESISTOR, American symbol
R8-R11 R13 R15 R16 = SparkFun-Resistors:RESISTOR: Generic Resistor Package
R28-R33 = resistor:R-EU_: RESISTOR, European symbol
U1 = maholli:MAX708RESA-T; MANUFACTURER_PART_NUMBER: MAX708RESAT; VENDOR: ON Semiconductor
U2 = BrownSpaceEngineering:LTC4121-4.2
U3 = SparkFun-Sensors:LSM9DS1: LSM9DS1 3D accelerometer, gyroscope & magnetometer The LSM9DS1 is a system-in-package featuring a 3D digital linear acceleration sensor, a 3D digital angular rate sensor, and a 3D digital magnetic sensor. The LSM9DS1 has a linear acceleration full scale of ±2g/±4g/±8/±16 g, a magnetic field full scale of ±4/±8/±12/±16 gauss and an angular rate of ±245/±500/±2000 dps. The LSM9DS1 includes an I2 C serial bus interface supporting standard and fast mode (100 kHz and 400 kHz) and an SPI serial standard interface. Magnetic, accelerometer and gyroscope sensing can be enabled or set in power-down mode separately for smart power management. The LSM9DS1 is available in a plastic land grid array package (LGA) and it is guaranteed to operate over an extended temperature range from -40 °C to +85 °C.; PROD_ID: IC-12536
U4 = maholli:MAX4372TEUK+T; MANUFACTURER_PART_NUMBER: MAX4372TEUK+T; VENDOR: Maxim Integrated Products
U5 = RFM23BP:RFM23BP: HopeRF RFM23BP Library by: http://projects.weber-itam.de; SPICEPREFIX: U
U6 = maholli:TPS54226PWPR; MANUFACTURER_PART_NUMBER: TPS54226PWPR; VENDOR: Texas Instruments
U7 = pandasat:ATSAMD51
U8 = pandasat:OKL-T3-W12
U10 U11 = pandasat:DRV8848
U12 = maholli:MR25H40MDF: NVRAM 4Mb 3.3V 512Kx8 SPI Source: Datasheet <https://www.everspin.com/file/217/download>; ARROW_PART_NUMBER: MR25H40MDF; ARROW_PRICE/STOCK: https://www.arrow.com/en/products/mr25h40mdf/everspin-technologies; DESCRIPTION: NVRAM 4Mb 3.3V 512Kx8 SPI; HEIGHT: 0.9mm; MANUFACTURER_NAME: Everspin Technologies; MANUFACTURER_PART_NUMBER: MR25H40MDF
X1 = pandasat:ECX-31B

## Net classes
0 default: width 0.152 mm, drill 0.3 mm, clearance 0.127 mm
1 diff pairs: width 0.203 mm